# EAGLE design cktDiag (EAGLE 6.4)
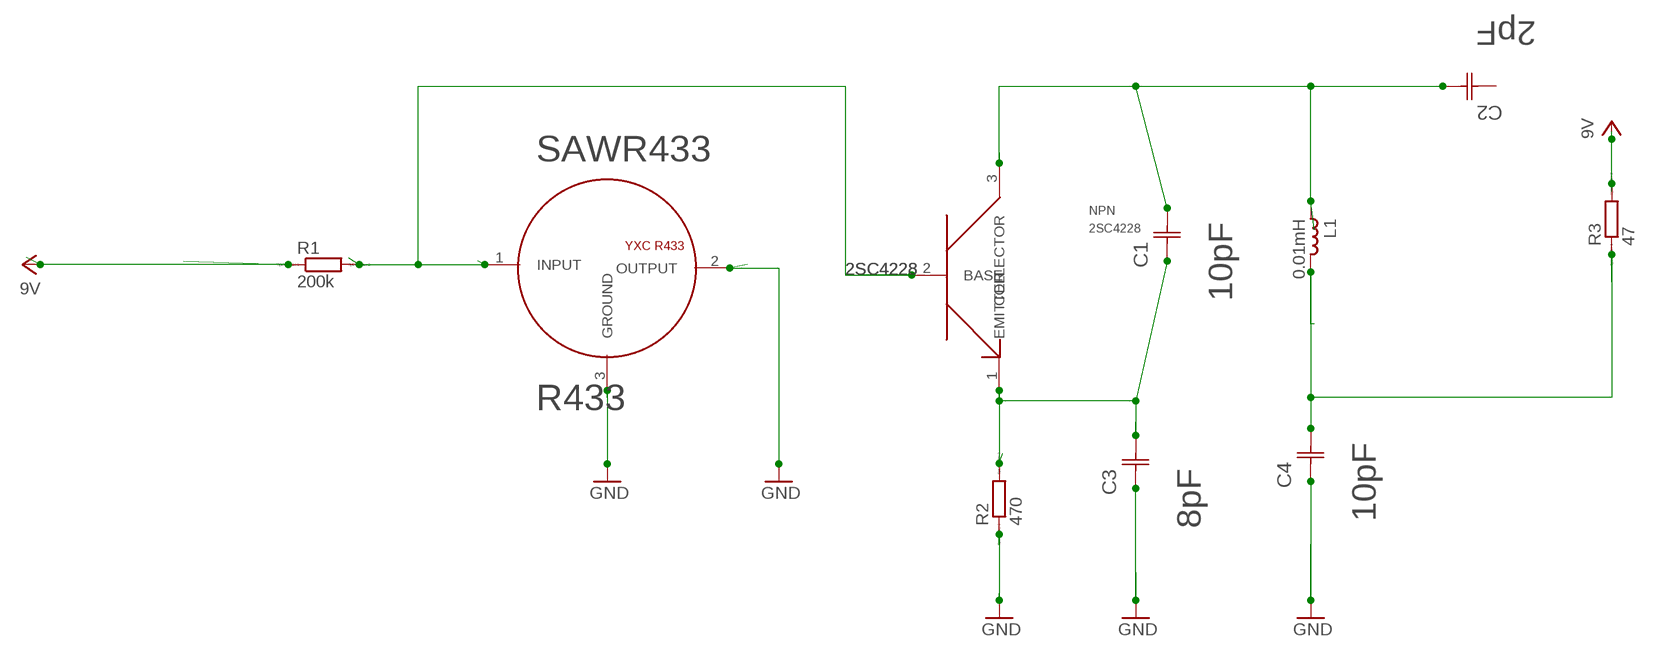
[diagram p0: schematic, sheet 1]

## Parts
C1  10pF  GRM1885C1H102JA01D  [CAPC1608X85N]
C2  2pF  GRM1885C1H102JA01D  [CAPC1608X85N]
C3  8pF  GRM1885C1H102JA01D  [CAPC1608X85N]
C4  10pF  GRM1885C1H102JA01D  [CAPC1608X85N]
L1  0.01mH  L_0603  [L0603]
NPN  2SC4228  [2SC4228]
R1  200k  RR0603  [R0603]
R2  470  RR0603  [R0603]
R3  47  RR0603  [R0603]
SAWR433  R433  [RX33]

## Nets
2SC4228: NPN.2(BASE) R1.2 SAWR433.1(INPUT)
GND: C3.1(C1) C4.1(C1) R2.1 SAWR433.2(OUTPUT) SAWR433.3(GROUND)
N$1: C1.1(C1) C3.2(C2) NPN.1(EMITTER) R2.2
N$5: C1.2(C2) C2.2(C2) L1.2 NPN.3(COLLECTOR)
N$9: C4.2(C2) L1.1 R3.1
VCC: R1.1 R3.2 ; supply symbol labelled 9V
Unconnected: C2.1(C1)

## Library data of the parts
C1-C4 = Murata_By_element14_Batch_1:GRM1885C1H102JA01D: CAPACITOR, 0603; MPN: GRM1885C1H102JA01D; OC_FARNELL: 8819920; OC_NEWARK: 38K1678; SUPPLIER: Murata; TOLERANCE: ±5%; VALUE: 1nF; VOLTAGERATING: 50V
L1 = rc-master-smd:L_: INDUCTOR
NPN = 2SC4228:2SC4228: High frequency low noise
R1-R3 = eagle-ltspice:R: RESISTOR, European symbol; SPICEMODEL: NONE; SPICEPREFIX: R
SAWR433 = saw:R433: SAW Resonator 433MHz

## Board
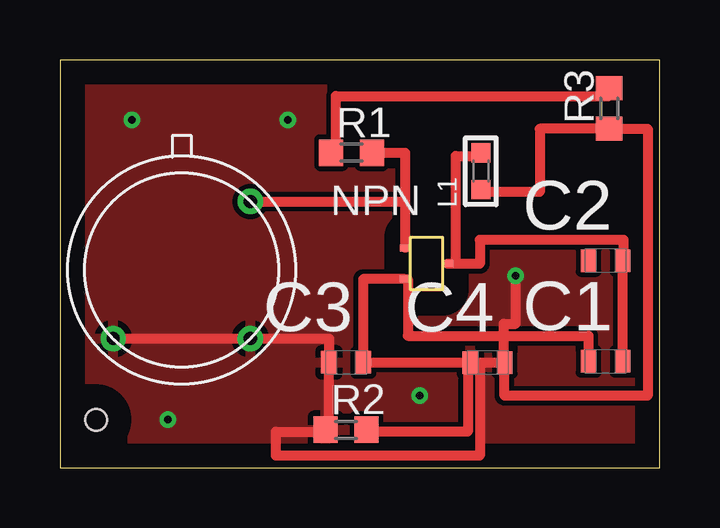
[diagram p1: board, top side]
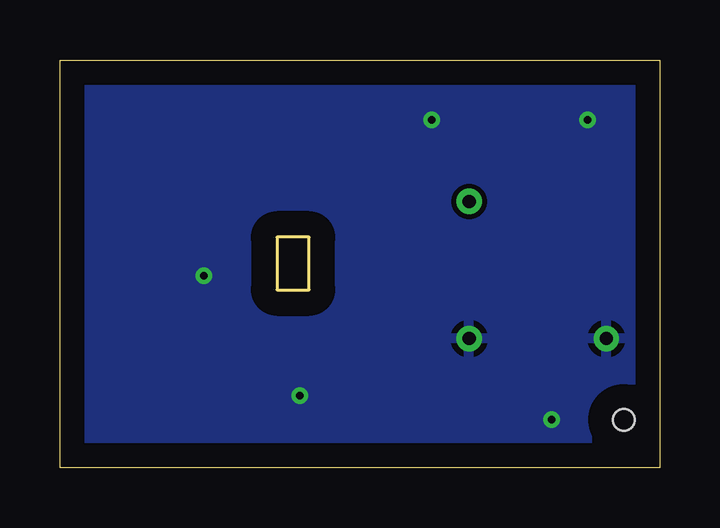
[diagram p2: board, bottom side, seen from below]

Size 25 x 17 mm. Coordinates in mm from the lower left corner, seen from the top.
Outline: 0,0 25,0 25,17 0,17 0,0
Copper layers (1*16): Top 0.035mm / dielectric 1.5mm / Bottom 0.035mm
Design rules "default": minimum track width 10mil, minimum drill 24mil, track to track 8mil, track to pad 8mil, pad to pad 8mil, via to via 8mil, smd to smd 8mil, copper to edge 40mil, drill to drill 8mil, minimum pad ring 10mil, minimum via ring 8mil, stop-mask expansion 4mil, vias tented up to drill 0mil, thermal gap 10mil
Holes 0.9 mm at 1.5,2

### Footprints (pad centres in the part's own frame; a part is rotated, then mirrored left to right if it is on the bottom)
CAPC1608X85N = smd 0.66 x 0.94: 1 -0.711,0; 2 0.711,0
L0603 = smd 0.8 x 0.8: 1 -0.762,0; 2 0.762,0
2SC4228 = smd 0.425 x 0.3: 1 -0.887,-0.65; 2 -0.887,0.65; 3 0.887,0
R0603 = smd 1 x 1.1: 1 -0.85,0; 2 0.85,0
RX33 = drill 0.55: 1 -2.86,2.86; 2 2.86,2.86; 3 2.86,-2.86

### Placement (x,y rotation side)
C1  22.75,4.43 0 top
C2  22.75,8.63 0 top
C3  11.93,4.39 0 top
C4  17.83,4.38 0 top
L1  17.55,12.36 90 top
NPN  15.28,8.51 0 top
R1  12.16,13.13 0 top
R2  11.93,1.58 0 top
R3  22.9,14.98 90 top
SAWR433  5.08,8.24 270 top

### Tracks (layer width: path | path; a pad name or v marks a point on that pad's centre or on a via)
2SC4228
  Top 0.406: R1.2 14.39,13.13 14.39,11.1 | 14.39,11.1 NPN.2 | SAWR433.1 14.39,11.1
GND  (via drill 0.3)
  Top 0.406: SAWR433.3 SAWR433.2 11.22,5.38 C3.1 11.22,1.58 R2.1 11.08,1.5 9,1.5 9,0.5 17.5,0.5 17.5,4.38 | C4.1 17.5,4.38 | 17.5,4.38 18.5,4.38 18.5,6 19,6 v19,8
  other vias: 9.5,14.5 3,14.5 4.5,2 15,3
  pour Top: -0.5,17.5 25.5,17.5 25.5,-0.5 -0.5,-0.5
  pour Bottom: -0.5,17.5 25.5,17.5 25.5,-0.5 -0.5,-0.5
N$1
  Top 0.406: C1.1 22.04,5.5 14.5,5.5 14.5,7.86 NPN.1 12.64,7.86 C3.2 17,4.39 | 17,4.39 17,4.5 | 17,4.39 17,1.5 12.78,1.5 R2.2
N$5
  Top 0.406: C1.2 C2.2 23.5,8.63 23.5,9.5 17.5,9.5 17.5,8.5 NPN.3 16.5,8.51 16.5,13 17.55,13 L1.2
N$9
  Top 0.406: L1.1 17.55,11.5 20,11.5 20,14.13 R3.1 24.5,14.13 24.5,3 18.54,3 C4.2
VCC
  Top 0.406: R1.1 11.5,13.13 11.5,15.5 22.9,15.5 R3.2